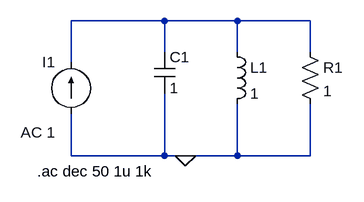
[diagram p0: schematic realim-c.asc]
realim-c.asc, the LTspice schematic file:
Version 4
SHEET 1 880 680
WIRE 96 64 -48 64
WIRE 208 64 96 64
WIRE 320 64 208 64
WIRE 96 112 96 64
WIRE 208 112 208 64
WIRE 320 112 320 64
WIRE -48 128 -48 64
WIRE -48 272 -48 208
WIRE 96 272 96 176
WIRE 96 272 -48 272
WIRE 128 272 96 272
WIRE 208 272 208 192
WIRE 208 272 128 272
WIRE 320 272 320 192
WIRE 320 272 208 272
FLAG 128 272 0
SYMBOL cap 80 112 R0
SYMATTR InstName C1
SYMATTR Value 1
SYMBOL ind 192 96 R0
SYMATTR InstName L1
SYMATTR Value 1
SYMBOL res 304 96 R0
SYMATTR InstName R1
SYMATTR Value 1
SYMBOL current -48 208 R180
WINDOW 0 24 80 Left 2
WINDOW 3 24 0 Left 2
WINDOW 123 24 -28 Left 2
WINDOW 39 0 0 Left 0
SYMATTR InstName I1
SYMATTR Value ""
SYMATTR Value2 AC 1
TEXT -100 296 Left 2 !.ac dec 50 1u 1k

The netlist it stands for:
* realim-c.asc
C1 N001 0 1
L1 N001 0 1
R1 N001 0 1
I1 0 N001 AC 1
.ac dec 50 1u 1k
.backanno
.end